# EAGLE design Lagorino_1_1 (EAGLE 7.5.0)
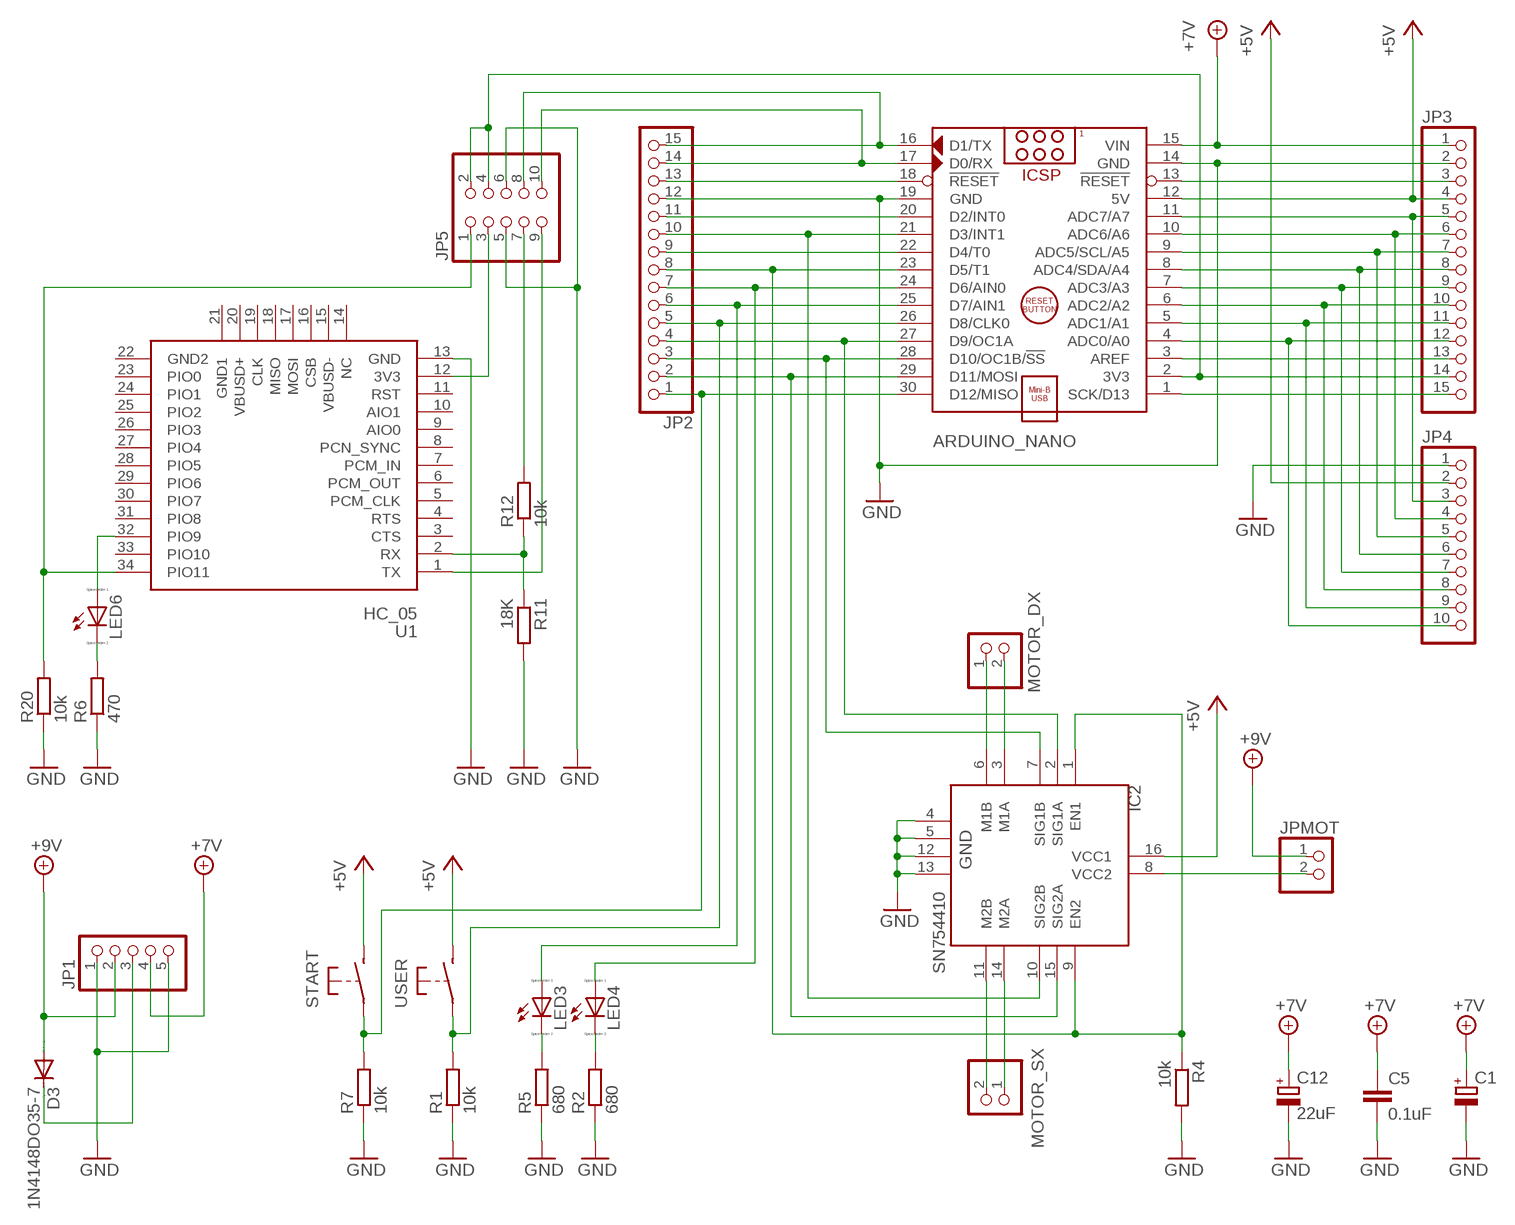
[diagram p0: schematic, sheet 1]

## Parts
ARDUINO_NANO  ARDUINO_NANO  [ARDUINO_NANO]
C1  CPOL-EUE5-6  [E5-6]
C5  0.1uF  C-EUC0805K  [C0805K]
C12  22uF  CPOL-EUA/3216-18W  [A/3216-18W]
D3  1N4148DO35-7  [DO35-7]
IC2  SN754410  [DIP16]
JP1  PINHD-1X5  [1X05]
JP2  PINHD-1X15  [1X15]
JP3  PINHD-1X15  [1X15]
JP4  PINHD-1X10  [1X10]
JP5  PINHD-2X5  [2X05]
JPMOT  PINHD-1X2  [1X02]
LED3  LED_E  [LED_1206]
LED4  LED_E  [LED_1206]
LED6  LED_E  [LED_1206]
MOTOR_DX  PINHD-1X2  [1X02]
MOTOR_SX  PINHD-1X2  [1X02]
R1  10k  R-EU_M0805  [M0805]
R2  680  R-EU_R0805  [R0805]
R4  10k  R-EU_M0805  [M0805]
R5  680  R-EU_R0805  [R0805]
R6  470  R-EU_R0805  [R0805]
R7  10k  R-EU_R0805  [R0805]
R11  18K  R-EU_M0805  [M0805]
R12  10k  R-EU_R0805  [R0805]
R20  10k  R-EU_M0805  [M0805]
START  SWITCH-MISC_FSM  [SWITCH-MISC_FSM]
U1  HC_05  [BLUETOOTH_SMD]
USER  SWITCH-MISC_FSM  [SWITCH-MISC_FSM]

## Nets
+5V: ARDUINO_NANO.12(5V) IC2.16(VCC1) JP3.4 JP4.2 START.P$2(S) USER.P$2(S)
+7V: ARDUINO_NANO.15(VIN) C1.+ C5.1 C12.+ JP1.4 JP3.1
+9V: D3.A JP1.2 JPMOT.1
GND: ARDUINO_NANO.14(GND) ARDUINO_NANO.19(GND) C1.- C5.2 C12.- IC2.4 IC2.5 IC2.12 IC2.13 JP1.1 JP1.5 JP2.12 JP3.2 JP4.1 JP5.5 JP5.6 R1.1 R2.1 R4.2 R5.1 R6.1 R7.1 R11.2 R20.1 U1.13(GND)
N$1: JP5.7 R12.2
N$2: JP5.9 U1.1(TX)
N$3: IC2.8(VCC2) JPMOT.2
N$4: D3.C JP1.3
N$5: IC2.6(M1B) MOTOR_DX.1
N$6: ARDUINO_NANO.27(D9/OC1A) IC2.2(SIG1A) JP2.4
N$7: ARDUINO_NANO.26(D8/CLK0) JP2.5 R1.2 USER.P$1(P)
N$8: ARDUINO_NANO.25(D7/AIN1) JP2.6 LED3.A
N$9: ARDUINO_NANO.24(D6/AIN0) JP2.7 LED4.A
N$10: IC2.3(M1A) MOTOR_DX.2
N$11: ARDUINO_NANO.2(3V3) JP3.14 JP5.2 JP5.4
N$12: IC2.11(M2B) MOTOR_SX.2
N$14: IC2.14(M2A) MOTOR_SX.1
N$15: ARDUINO_NANO.13(!RESET) JP3.3
N$16: ARDUINO_NANO.17(D0/RX) JP2.14 JP5.10
N$17: ARDUINO_NANO.16(D1/TX) JP2.15 JP5.8
N$18: ARDUINO_NANO.29(D11/MOSI) IC2.15(SIG2A) JP2.2
N$20: ARDUINO_NANO.3(AREF) JP3.13
N$22: ARDUINO_NANO.11(ADC7/A7) JP3.5 JP4.3
N$23: R11.1 R12.1 U1.2(RX)
N$24: ARDUINO_NANO.10(ADC6/A6) JP3.6 JP4.4
N$25: ARDUINO_NANO.9(ADC5/SCL/A5) JP3.7 JP4.5
N$26: ARDUINO_NANO.8(ADC4/SDA/A4) JP3.8 JP4.6
N$27: JP5.3 U1.12(3V3)
N$28: ARDUINO_NANO.1(SCK/D13) JP3.15
N$30: ARDUINO_NANO.7(ADC3/A3) JP3.9 JP4.7
N$32: ARDUINO_NANO.6(ADC2/A2) JP3.10 JP4.8
N$33: ARDUINO_NANO.5(ADC1/A1) JP3.11 JP4.9
N$34: ARDUINO_NANO.4(ADC0/A0) JP3.12 JP4.10
N$35: ARDUINO_NANO.18(!RESET) JP2.13
N$37: ARDUINO_NANO.20(D2/INT0) JP2.11
N$38: LED4.C R2.2
N$39: LED3.C R5.2
N$42: ARDUINO_NANO.30(D12/MISO) JP2.1 R7.2 START.P$1(P)
N$43: ARDUINO_NANO.22(D4/T0) JP2.9
N$44: ARDUINO_NANO.21(D3/INT1) IC2.10(SIG2B) JP2.10
N$45: ARDUINO_NANO.28(D10/OC1B/!SS) IC2.7(SIG1B) JP2.3
N$46: ARDUINO_NANO.23(D5/T1) IC2.1(EN1) IC2.9(EN2) JP2.8 R4.1
N$49: LED6.C R6.2
N$51: LED6.A U1.32(PIO9)
N$53: JP5.1 R20.2 U1.34(PIO11)
Unconnected: U1.3(CTS) U1.4(RTS) U1.5(PCM_CLK) U1.6(PCM_OUT) U1.7(PCM_IN) U1.8(PCN_SYNC) U1.9(AIO0) U1.10(AIO1) U1.11(RST) U1.14(NC) U1.15(VBUSD-) U1.16(CSB) U1.17(MOSI) U1.18(MISO) U1.19(CLK) U1.20(VBUSD+) U1.21(GND1) U1.22(GND2) U1.23(PIO0) U1.24(PIO1) U1.25(PIO2) U1.26(PIO3) U1.27(PIO4) U1.28(PIO5) U1.29(PIO6) U1.30(PIO7) U1.31(PIO8) U1.33(PIO10)

## Library data of the parts
ARDUINO_NANO = ArduinoNanoV30:ARDUINO_NANO: Arduino Nano V3.0 Module Overview: The Arduino Nano is a small, complete, and breadboard-friendly board based on the ATmega328 (Arduino Nano 3.x) or ATmega168 (Arduino Nano 2.x). It has more or less the same functionality of the Arduino Duemilanove, but in a different package. It lacks only a DC power jack, and works with a Mini-B USB cable instead of a standard one. The Nano was designed and is being produced by Gravitech <http://www.gravitech.us/arna30wiatp.html>. General specifications: Item Value Microcontroller Atmel ATmega168 or ATmega328 Operating Voltage (logic level) 5 V Input Voltage (recommended) 7-12 V Input Voltage (limits) 6-20 V Digital I/O Pins 14 (of which 6 provide PWM output) Analog Input Pins 8 DC Current per I/O Pin 40 mA Flash Memory 16 KB (ATmega168) or 32 KB (ATmega328) of which 2 KB used by bootloader SRAM 1 KB (ATmega168) or 2 KB (ATmega328) EEPROM 512 bytes (ATmega168) or 1 KB (ATmega328) Clock Speed 16 MHz Dimensions (Inches) 0.73" x 1.70" Dimensions (mm) 18mm x 45mm Overall height About 9 mm (not including pins) Weigth 5 g Power: The Arduino Nano can be powered via the Mini-B USB connection, 6-20V unregulated external power supply (pin 30), or 5V regulated external power supply (pin 27). The power source is automatically selected to the highest voltage source. Memory: The ATmega168 has 16 KB of flash memory for storing code (of which 2 KB is used for the bootloader); the ATmega328 has 32 KB, (also with 2 KB used for the bootloader). The ATmega168 has 1 KB of SRAM and 512 bytes of EEPROM (which can be read and written with the EEPROM library); the ATmega328 has 2 KB of SRAM and 1 KB of EEPROM. Input and Output: Each of the 14 digital pins on the Nano can be used as an input or output, using pinMode(), digitalWrite(), and digitalRead() functions. They operate at 5 volts. Each pin can provide or receive a maximum of 40 mA and has an internal pull-up resistor (disconnected by default) of 20-50 kOhms. In addition, some pins have specialized functions. Visit Arduino - ArduinoBoardNano <https://www.arduino.cc/en/Main/ArduinoBoardNano>
C1 C12 = rcl:CPOL-EU: POLARIZED CAPACITOR, European symbol
C5 = rcl:C-EU: CAPACITOR, European symbol
D3 = diode:1N4148: DIODE high speed (Philips)
IC2 = HBridge:SN754410: Quadruple half-H driver
JP1 = pinhead:PINHD-1X5: PIN HEADER
JP2 JP3 = pinhead:PINHD-1X15: PIN HEADER
JP4 = pinhead:PINHD-1X10: PIN HEADER
JP5 = pinhead:PINHD-2X5: PIN HEADER
JPMOT MOTOR_DX MOTOR_SX = pinhead:PINHD-1X2: PIN HEADER
LED3 LED4 LED6 = eagle-ltspice:LED_E: LED Source: http://www.osram.convergy.de Source: www.luxeon.com Source: www.kingbright.com; SPICEMODEL: NONE; SPICEPREFIX: D; SPICETYPE: diode
R1 R2 R4-R7 R11 R12 R20 = rcl:R-EU_: RESISTOR, European symbol
START USER = SimpleBot_v1.0:SWITCH-MISC_FSM: TYCO SWITCH
U1 = SerialPortBluetooth:HC_05

## Board
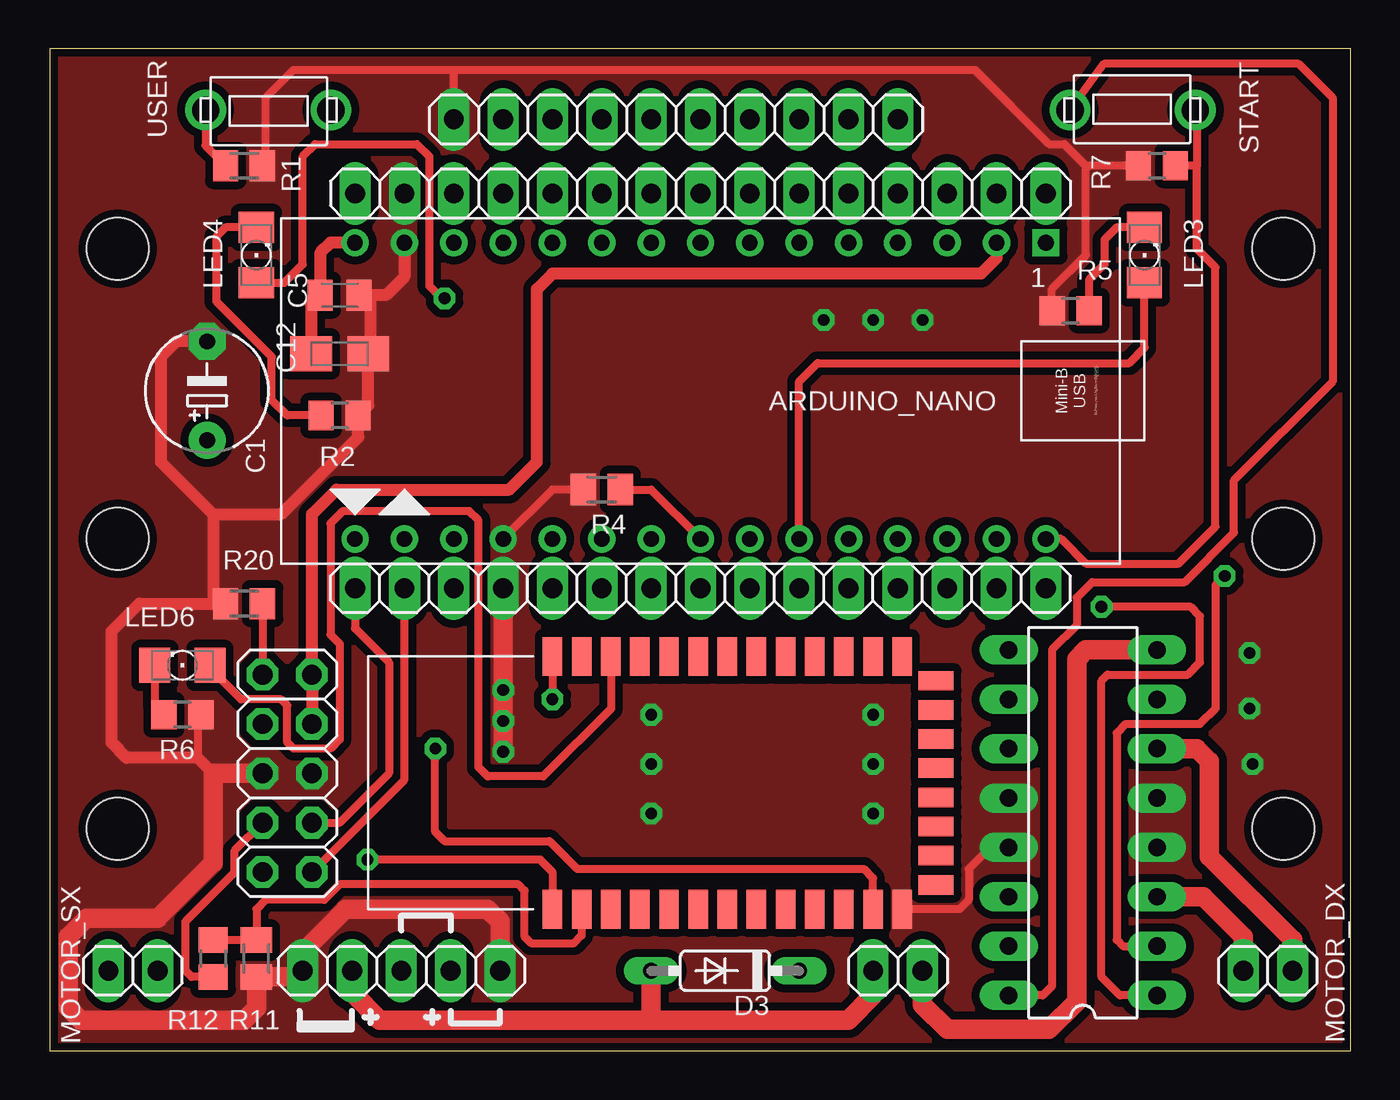
[diagram p1: board, top side]
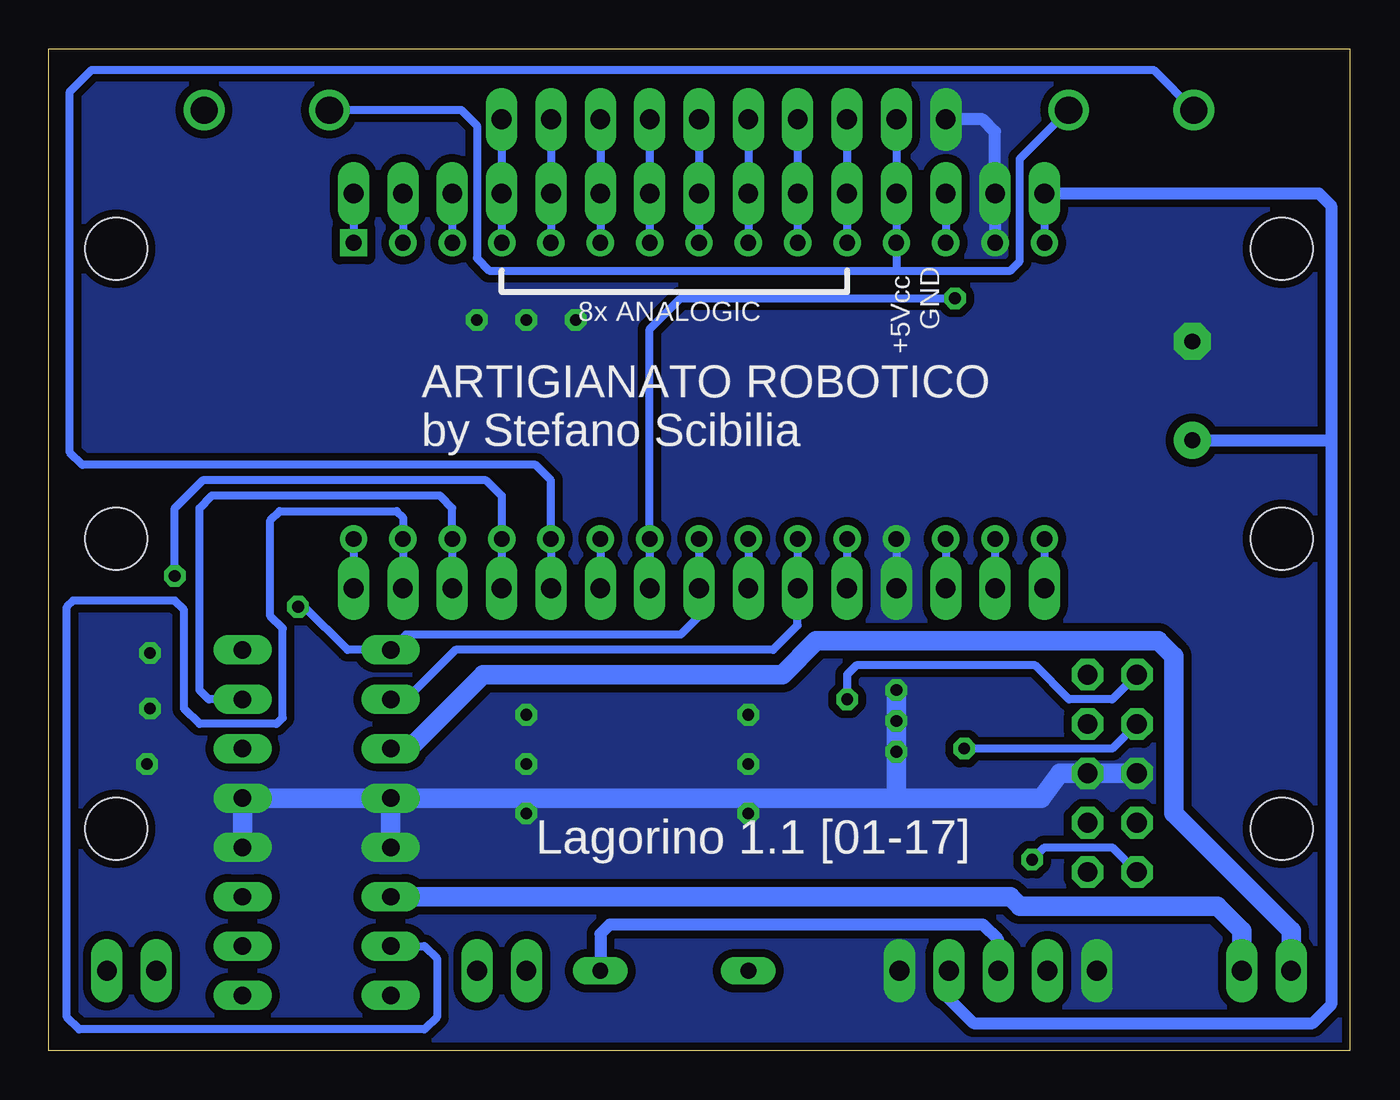
[diagram p2: board, bottom side, seen from below]

Size 66.98 x 51.58 mm. Coordinates in mm from the lower left corner, seen from the top.
Outline: 0,0 66.98,0 66.98,51.58 0,51.58 0,0
Copper layers (1*16): Top 0.035mm / dielectric 1.5mm / Bottom 0.035mm
Design rules "SparkFun": minimum track width 8mil, minimum drill 20mil, track to track 8mil, track to pad 8mil, pad to pad 8mil, via to via 8mil, smd to smd 8mil, copper to edge 10mil, drill to drill 8mil, minimum pad ring 12mil, minimum via ring 10mil, stop-mask expansion 4mil, vias tented up to drill 25mil, thermal gap 10mil
Holes 3.2 mm at 3.49,41.27 3.49,26.35 3.49,11.43 63.5,26.35 63.5,11.43 63.5,41.27

### Footprints (pad centres in the part's own frame; a part is rotated, then mirrored left to right if it is on the bottom)
ARDUINO_NANO = drill 0.8 square: 1 -20.32,-7.62 | drill 0.8: 2 -17.78,-7.62; 3 -15.24,-7.62; 4 -12.7,-7.62; 5 -10.16,-7.62; 6 -7.62,-7.62; 7 -5.08,-7.62; 8 -2.54,-7.62; 9 0,-7.62; 10 2.54,-7.62; 11 5.08,-7.62; 12 7.62,-7.62; 13 10.16,-7.62; 14 12.7,-7.62; 15 15.24,-7.62; 16 15.24,7.62; 17 12.7,7.62; 18 10.16,7.62; 19 7.62,7.62; 20 5.08,7.62; 21 2.54,7.62; 22 0,7.62; 23 -2.54,7.62; 24 -5.08,7.62; 25 -7.62,7.62; 26 -10.16,7.62; 27 -12.7,7.62; 28 -15.24,7.62; 29 -17.78,7.62; 30 -20.32,7.62
E5-6 = drill 0.813 pad 1.905: + -2.54,0 | drill 0.813 pad 1.905 octagon: - 2.54,0
C0805K = smd 1.3 x 1.6: 1 -1,0; 2 1,0
A/3216-18W = smd 2.15 x 1.8: + 1.475,0; - -1.475,0
DO35-7 = drill 0.813 long: A 3.81,0; C -3.81,0
DIP16 = drill 0.9 long: 1 -10.16,-3.81; 2 -7.62,-3.81; 3 -5.08,-3.81; 4 -2.54,-3.81; 5 0,-3.81; 6 2.54,-3.81; 7 5.08,-3.81; 8 7.62,-3.81; 9 7.62,3.81; 10 5.08,3.81; 11 2.54,3.81; 12 0,3.81; 13 -2.54,3.81; 14 -5.08,3.81; 15 -7.62,3.81; 16 -10.16,3.81
1X05 = drill 1.016 long: 1 -5.08,0; 2 -2.54,0; 3 0,0; 4 2.54,0; 5 5.08,0
1X15 = drill 1.016 long: 1 -17.78,0; 2 -15.24,0; 3 -12.7,0; 4 -10.16,0; 5 -7.62,0; 6 -5.08,0; 7 -2.54,0; 8 0,0; 9 2.54,0; 10 5.08,0; 11 7.62,0; 12 10.16,0; 13 12.7,0; 14 15.24,0; 15 17.78,0
1X10 = drill 1.016 long: 1 -11.43,0; 2 -8.89,0; 3 -6.35,0; 4 -3.81,0; 5 -1.27,0; 6 1.27,0; 7 3.81,0; 8 6.35,0; 9 8.89,0; 10 11.43,0
2X05 = drill 1.016 octagon: 1 -5.08,-1.27; 2 -5.08,1.27; 3 -2.54,-1.27; 4 -2.54,1.27; 5 0,-1.27; 6 0,1.27; 7 2.54,-1.27; 8 2.54,1.27; 9 5.08,-1.27; 10 5.08,1.27
1X02 = drill 1.016 long: 1 -1.27,0; 2 1.27,0
LED_1206 = smd 1.6 x 1.803: A -1.422,0; C 1.422,0
M0805 = smd 1.3 x 1.6: 1 -0.95,0; 2 0.95,0
R0805 = smd 1.3 x 1.5: 1 -0.95,0; 2 0.95,0
SWITCH-MISC_FSM = drill 1.397: P$1 0,3.25; P$2 0,-3.2
BLUETOOTH_SMD = smd 2 x 1: 1 0,0; 2 0,-1.5; 3 0,-3; 4 0,-4.5; 5 0,-6; 6 0,-7.5; 7 0,-9; 8 0,-10.5; 9 0,-12; 10 0,-13.5; 11 0,-15; 12 0,-16.5; 13 0,-18; 22 13,-18; 23 13,-16.5; 24 13,-15; 25 13,-13.5; 26 13,-12; 27 13,-10.5; 28 13,-9; 29 13,-7.5; 30 13,-6; 31 13,-4.5; 32 13,-3; 33 13,-1.5; 34 13,0 | smd 1 x 1.8: 14 1.25,-19.75; 15 2.75,-19.75; 16 4.25,-19.75; 17 5.75,-19.75; 18 7.25,-19.75; 19 8.75,-19.75; 20 10.25,-19.75; 21 11.75,-19.75

### Placement (x,y rotation side)
ARDUINO_NANO  30.96,33.97 180 top
C1  8.1,33.97 90 top
C5  14.92,38.89 0 top
C12  14.92,35.88 180 top
D3  34.77,4.13 180 top
IC2  53.18,13.02 90 top
JP1  18.1,4.13 0 top
JP2  33.5,23.81 180 top
JP3  33.5,44.13 0 top
JP4  32.23,47.94 0 top
JP5  12.22,14.29 270 top
JPMOT  43.66,4.13 0 top
LED3  56.36,40.96 90 top
LED4  10.64,40.96 90 top
LED6  6.83,19.84 180 top
MOTOR_DX  62.71,4.13 180 top
MOTOR_SX  4.29,4.13 180 top
R1  10,45.56 180 top
R2  14.92,32.7 180 top
R4  28.42,28.89 180 top
R5  52.55,38.1 0 top
R6  6.83,17.3 180 top
R7  56.99,45.56 0 top
R11  10.64,4.76 270 top
R12  8.41,4.76 270 top
R20  10,23.02 0 top
START  55.72,48.42 270 top
U1  25.88,7.3 90 top
USER  11.27,48.42 90 top

### Tracks (layer width: path | path; a pad name or v marks a point on that pad's centre or on a via)
+5V
  Top 0.406: START.P$2 54.27,50.8 64.29,50.8 66.04,49.05 66.04,34.45 60.96,29.37 60.96,26.67 58.42,24.13 53.66,24.13 52.86,23.34 52.86,21.91 51.59,20.64 51.59,3.33 51.12,2.86 IC2.16
  Bottom 0.406: JP4.2 JP3.4 ARDUINO_NANO.12 23.34,40.16 | START.P$2 45.72,48.42 44.93,47.62 44.93,40.8 44.29,40.16 23.34,40.16 | 23.34,40.16 17.46,40.16 16.99,40.64 16.99,45.9 USER.P$2
+7V
  Top 0.61: ARDUINO_NANO.15 14.45,41.59 13.92,41.07 C5.1 13.45,38.42 C12.+
  Bottom 0.406: JP3.1 ARDUINO_NANO.15
  Bottom 0.61: JP1.4 20.64,2.7 19.37,1.43 1.91,1.43 0.95,2.38 0.95,31.43 | JP3.1 1.59,44.13 0.95,43.5 0.95,31.43 | C1.+ 0.95,31.43
+9V
  Top 1.016: JPMOT.1 42.39,2.86 41.12,1.59 30.96,1.59 | JP1.2 15.56,3.02 16.99,1.59 30.96,1.59 | D3.A 30.96,1.59
GND  (via drill 0.6)
  Top 0.406: IC2.13 48.42,10.48 47.31,9.37 47.31,7.78 46.83,7.3 U1.13 | R7.1 53.5,45.56 | 53.5,45.56 53.34,45.56 52.23,46.67 51.44,46.67 47.62,50.48 20.8,50.48 | R5.1 51.6,39.21 53.34,40.96 53.34,45.4 53.5,45.56 | R4.2 25.88,28.89 ARDUINO_NANO.19 | R6.1 7.62,17.15 7.62,15.08 | R1.1 11.11,45.72 11.11,49.05 12.54,50.48 20.8,50.48 | 20.8,50.48 JP4.1
  Top 0.61: 8.41,14.29 7.62,15.08 3.97,15.08 3.17,15.88 3.17,21.59 4.6,23.02 8.41,23.02 | 8.41,23.02 R20.1 | C1.- 6.51,36.51 5.71,35.72 5.71,30.32 8.41,27.62 | 8.41,27.62 8.41,23.02 | 8.41,27.62 11.91,27.62 15.87,31.59 R2.1 16.4,33.23 C12.- 16.51,35.99 16.51,38.89 | ARDUINO_NANO.14 18.26,39.85 17.3,38.89 16.51,38.89 | 16.51,38.89 C5.2
  Top 1.016: JP1.5 23.18,6.67 22.54,7.3 15.24,7.3 13.02,5.08 JP1.1 12.7,3.81 R11.2 10.64,2.22 10,1.59 1.59,1.59 0.95,2.22 0.95,5.87 1.91,6.83 5.56,6.83 8.41,9.68 8.41,14.29 JP5.5 | JP2.12 v23.34,18.57 v23.34,15.4
  Bottom 0.406: ARDUINO_NANO.19 JP2.12
  Bottom 0.61: ARDUINO_NANO.14 JP3.2 18.26,47.31 18.89,47.94 JP4.1
  Bottom 1.016: JP5.5 JP5.6 14.92,14.29 15.88,13.02 23.34,13.02 | IC2.4 IC2.5 IC2.12 | IC2.12 IC2.13 | 23.34,13.02 IC2.12 | 23.34,13.02 v23.34,15.4 v23.34,16.99 v23.34,18.57
  other vias: 39.85,37.62 42.39,37.62 44.93,37.62 42.39,17.3 42.39,14.76 42.39,12.22 30.96,17.3 30.96,14.76 30.96,12.22 61.75,20.48 61.75,17.62 61.91,14.76
  pour Top (isolate 0.406, no thermals): 0,51.59 67.15,51.59 67.15,0 0,0
  pour Bottom (isolate 0.406, no thermals): 0,51.59 66.99,51.59 66.99,0 0,0
N$1
  Top 0.406: R12.2 7.3,3.81 6.99,4.13 6.99,6.67 9.53,9.21 9.53,10.32 JP5.7
N$2  (via drill 0.6)
  Top 0.406: U1.1 25.88,9.21 25.24,9.84 v16.35,9.84
  Bottom 0.406: v16.35,9.84 15.72,10.48 12.22,10.48 JP5.9
N$3
  Top 1.016: JPMOT.2 44.93,2.38 46.2,1.11 51.44,1.11 52.86,2.54 52.86,20.16 53.34,20.64 IC2.8
N$4
  Bottom 0.61: JP1.3 18.1,5.71 18.89,6.51 38.1,6.51 38.58,6.03 D3.C
N$5
  Top 1.016: MOTOR_DX.1 63.98,5.71 59.69,10 59.69,14.92 59.05,15.56 IC2.6
N$6  (via drill 0.6)
  Top 0.406: IC2.2 55.24,5.4 54.93,5.71 54.93,16.35 55.4,16.83 59.21,16.83 60.01,17.62 60.01,23.97 v60.48,24.45
  Bottom 0.406: v60.48,24.45 60.48,27.94 59.05,29.37 44.45,29.37 43.66,28.57 ARDUINO_NANO.27 JP2.4
N$7
  Top 0.406: USER.P$1 8.02,46.59 R1.2
  Bottom 0.406: JP2.5 ARDUINO_NANO.26 41.12,29.37 41.91,30.16 65.25,30.16 65.88,30.8 65.88,49.37 64.77,50.48 10.09,50.48 USER.P$1
N$8
  Top 0.406: ARDUINO_NANO.25 38.58,34.45 39.53,35.4 55.56,35.4 56.36,36.2 LED3.A
  Bottom 0.406: ARDUINO_NANO.25 JP2.6
N$9  (via drill 0.6)
  Top 0.406: LED4.A 12.06,39.53 13.02,40.48 13.02,46.04 13.65,46.67 18.89,46.67 19.53,46.04 19.53,39.37 20.16,38.73 v20.32,38.73
  Bottom 0.406: JP2.7 ARDUINO_NANO.24 36.04,37.15 34.45,38.73 v20.32,38.73
N$10
  Top 1.016: IC2.3 59.37,7.94 61.44,5.87 MOTOR_DX.2
N$11
  Top 0.61: JP5.4 JP5.2 13.49,27.62 14.76,28.89 23.65,28.89 25.08,30.32 25.08,39.21 25.88,40.01 47.94,40.01 48.74,40.8 ARDUINO_NANO.2
  Bottom 0.406: JP3.14 ARDUINO_NANO.2
N$12
  Bottom 1.016: MOTOR_SX.2 3.02,6.19 9.05,12.22 9.05,20.32 9.84,21.11 27.46,21.11 29.21,19.37 44.61,19.37 48.42,15.56 IC2.11
N$14
  Bottom 1.016: MOTOR_SX.1 5.56,6.19 6.83,7.46 16.99,7.46 17.46,7.94 IC2.14
N$15
  Bottom 0.406: JP3.3 ARDUINO_NANO.13
N$16
  Top 0.406: JP5.10 18.26,13.97 JP2.14
  Bottom 0.406: ARDUINO_NANO.17 JP2.14
N$17
  Top 0.406: JP5.8 14.92,11.75 17.46,14.29 17.46,20 15.72,21.75 JP2.15
  Bottom 0.406: ARDUINO_NANO.16 JP2.15
N$18
  Bottom 0.406: JP2.2 ARDUINO_NANO.29 48.74,27.46 49.05,27.78 55.09,27.78 55.56,27.3 55.56,22.38 54.93,21.75 54.93,17.14 55.24,16.83 59.21,16.83 60.01,17.62 60.01,22.7 60.48,23.18 65.72,23.18 66.04,22.86 66.04,1.75 65.41,1.11 47.62,1.11 46.99,1.75 46.99,4.76 47.62,5.4 IC2.15
N$20
  Bottom 0.406: JP3.13 ARDUINO_NANO.3
N$22
  Bottom 0.406: JP4.3 JP3.5 ARDUINO_NANO.11
N$23
  Top 0.406: R12.1 R11.1 10.64,7.3 11.11,7.78 14.13,7.78 14.92,8.57 24.13,8.57 24.45,8.26 24.45,5.87 24.77,5.56 26.99,5.56 27.38,5.95 U1.2
N$24
  Bottom 0.406: JP4.4 JP3.6 ARDUINO_NANO.10
N$25
  Bottom 0.406: JP4.5 JP3.7 ARDUINO_NANO.9
N$26
  Bottom 0.406: JP4.6 JP3.8 ARDUINO_NANO.8
N$27  (via drill 0.6)
  Top 0.406: v19.84,15.56 19.84,11.27 20.32,10.79 25.72,10.79 27.15,9.37 41.91,9.37 42.39,8.89 42.39,7.31 U1.12
  Bottom 0.406: JP5.3 12.22,15.56 v19.84,15.56
N$28
  Bottom 0.406: JP3.15 ARDUINO_NANO.1
N$30
  Bottom 0.406: JP4.7 JP3.9 ARDUINO_NANO.7
N$32
  Bottom 0.406: JP4.8 JP3.10 ARDUINO_NANO.6
N$33
  Bottom 0.406: JP4.9 JP3.11 ARDUINO_NANO.5
N$34
  Bottom 0.406: JP4.10 JP3.12 ARDUINO_NANO.4
N$35
  Bottom 0.406: ARDUINO_NANO.18 JP2.13
N$37
  Bottom 0.406: ARDUINO_NANO.20 JP2.11
N$38
  Top 0.406: LED4.C 9.05,42.39 8.57,41.91 8.57,38.58 11.43,35.72 11.43,33.5 12.22,32.7 R2.2
N$39
  Top 0.406: LED3.C 54.92,42.38 54.29,41.75 54.29,40.48 53.5,39.69 R5.2
N$42
  Top 0.406: ARDUINO_NANO.30 52.07,26.35 53.34,25.08 58.1,25.08 60.01,26.99 60.01,40.32 59.05,41.27 59.05,45.56 | START.P$1 59.05,48.34 59.05,45.56 | 59.05,45.56 R7.2
  Bottom 0.406: ARDUINO_NANO.30 JP2.1
N$43
  Bottom 0.406: ARDUINO_NANO.22 JP2.9
N$44
  Bottom 0.406: ARDUINO_NANO.21 JP2.10 28.42,21.91 29.69,20.64 46.04,20.64 48.58,18.1 IC2.10
N$45
  Bottom 0.406: JP2.3 ARDUINO_NANO.28 46.2,27.94 46.83,28.57 58.58,28.57 59.21,27.94 59.21,18.57 58.74,18.1 IC2.7
N$46  (via drill 0.6)
  Top 0.406: IC2.1 55.09,2.86 54.13,3.81 54.13,19.05 54.45,19.37 58.58,19.37 59.21,20 59.21,22.38 58.74,22.86 v54.13,22.86 | R4.1 30.96,28.89 ARDUINO_NANO.23
  Bottom 0.406: ARDUINO_NANO.23 JP2.8 33.5,22.38 34.45,21.43 48.58,21.43 IC2.9 51.59,20.64 53.82,22.86 v54.13,22.86
N$49
  Top 0.406: LED6.C 5.4,17.78 R6.2
N$51
  Top 0.406: U1.32 28.89,20.29 28.89,17.62 25.4,14.13 22.54,14.13 22.07,14.61 22.07,27.3 21.59,27.78 15.08,27.78 14.45,27.15 14.45,21.43 14.92,20.95 14.92,16.03 14.45,15.56 12.54,15.56 12.22,15.88 12.22,17.78 11.91,18.1 9.84,18.1 8.25,19.69 LED6.A
N$53  (via drill 0.6)
  Top 0.406: U1.34 v25.88,18.1 | R20.2 JP5.1
  Bottom 0.406: JP5.1 12.22,18.1 14.45,18.1 16.19,19.84 25.4,19.84 25.88,19.37 v25.88,18.1

### Text on the board
bPlace: 8x ANALOGIC | +5Vcc / GND | ARTIGIANATO ROBOTICO / by Stefano Scibilia | Lagorino 1.1 [01-17]